# Altium schematic sheet 00_Welder_PSU.SchDoc
size A4; SheetNumber: 1; SheetTotal: 3
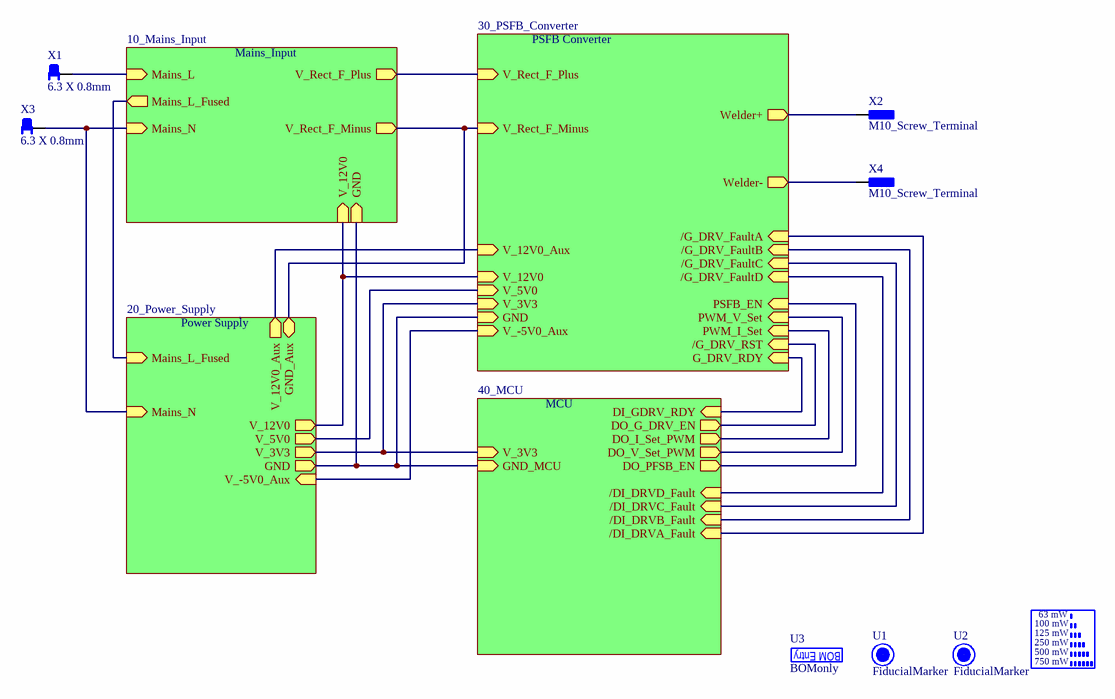
[diagram p0: 00_Welder_PSU.SchDoc]

## Parts
U1  FiducialMarker  [FiducialMarker]  (no BOM)
U2  FiducialMarker  [FiducialMarker]  (no BOM)
U3  BOMonly  (mechanical)
U?  ROVERVIEW  (value not drawn)  (graphical)
X1  6.3 X 0.8mm  [X01_FastonPCBTab6.3mm1.8mmHole]
X2  M10_Screw_Terminal  [X01_M10_7461061]
X3  6.3 X 0.8mm  [X01_FastonPCBTab6.3mm1.8mmHole]
X4  M10_Screw_Terminal  [X01_M10_7461061]

## Sub-sheets
Mains_Input = 10_Mains_Input: Mains_L (in), Mains_N (in), V_Rect_F_Plus (out), V_Rect_F_Minus (out), V_12V0 (in), GND (in), Mains_L_Fused (out)
MCU = 40_MCU: DO_I_Set_PWM (out), DO_V_Set_PWM (out), DO_PFSB_EN (out), V_3V3 (in), GND_MCU (in), DO_G_DRV_EN (out), /DI_DRVA_Fault (in), /DI_DRVB_Fault (in), /DI_DRVC_Fault (in), /DI_DRVD_Fault (in), DI_GDRV_RDY (in)
Power Supply = 20_Power_Supply: Mains_N (in), V_12V0 (out), V_5V0 (out), V_3V3 (out), GND (out), GND_Aux (bidir), V_12V0_Aux (out), V_-5V0_Aux (in), Mains_L_Fused (in)
PSFB Converter = 30_PSFB_Converter: V_Rect_F_Minus (in), V_Rect_F_Plus (in), V_12V0 (in), V_5V0 (in), V_3V3 (in), GND (in), PWM_I_Set (in), PWM_V_Set (in), PSFB_EN (in), Welder+ (out), Welder- (out), V_12V0_Aux (in), V_-5V0_Aux (in), /G_DRV_RST (in), /G_DRV_FaultA (in), /G_DRV_FaultC (in), /G_DRV_FaultB (in), /G_DRV_FaultD (in), G_DRV_RDY (in)

## Nets
NetX1_1: X1.1 ; sheet Mains_Input/Mains_L
NetX2_1: X2.1 ; sheet PSFB Converter/Welder+
NetX3_1: X3.1 ; sheet Mains_Input/Mains_N, sheet Power Supply/Mains_N
NetX4_1: X4.1 ; sheet PSFB Converter/Welder-
(unnamed): sheet Mains_Input/V_Rect_F_Plus, sheet PSFB Converter/V_Rect_F_Plus
(unnamed): sheet Mains_Input/V_Rect_F_Minus, sheet PSFB Converter/V_Rect_F_Minus, sheet Power Supply/GND_Aux
(unnamed): sheet Mains_Input/V_12V0, sheet PSFB Converter/V_12V0, sheet Power Supply/V_12V0
(unnamed): sheet Mains_Input/GND, sheet PSFB Converter/GND, sheet Power Supply/GND, sheet MCU/GND_MCU
(unnamed): sheet Mains_Input/Mains_L_Fused, sheet Power Supply/Mains_L_Fused
(unnamed): sheet PSFB Converter/V_5V0, sheet Power Supply/V_5V0
(unnamed): sheet PSFB Converter/V_3V3, sheet Power Supply/V_3V3, sheet MCU/V_3V3
(unnamed): sheet PSFB Converter/PWM_I_Set, sheet MCU/DO_I_Set_PWM
(unnamed): sheet PSFB Converter/PWM_V_Set, sheet MCU/DO_V_Set_PWM
(unnamed): sheet PSFB Converter/PSFB_EN, sheet MCU/DO_PFSB_EN
(unnamed): sheet PSFB Converter/V_12V0_Aux, sheet Power Supply/V_12V0_Aux
(unnamed): sheet PSFB Converter/V_-5V0_Aux, sheet Power Supply/V_-5V0_Aux
(unnamed): sheet PSFB Converter//G_DRV_RST, sheet MCU/DO_G_DRV_EN
(unnamed): sheet PSFB Converter//G_DRV_FaultA, sheet MCU//DI_DRVA_Fault
(unnamed): sheet PSFB Converter//G_DRV_FaultC, sheet MCU//DI_DRVC_Fault
(unnamed): sheet PSFB Converter//G_DRV_FaultB, sheet MCU//DI_DRVB_Fault
(unnamed): sheet PSFB Converter//G_DRV_FaultD, sheet MCU//DI_DRVD_Fault
(unnamed): sheet PSFB Converter/G_DRV_RDY, sheet MCU/DI_GDRV_RDY

Not connected (* = marked no-connect by the designer): U1 1; U2 1

## Notes on the sheet
- Assembly variant:
- DIN ISO 2768-mK
- DIN ISO 8015
- standards
- general
- replace for
- DIN EN ISO 1302
- surface
- material number
- description
- document
- number
- replace for index
- type
- version
- date
- drawn by
- checked
- File:
- mod.
- ind.
- quan.
- change number
- sheet
- of
- EBB
- ESP
- (in symbol 9) 63 mW; 100 mW; 125 mW; 250 mW; 500 mW; 750 mW; BOM Entry

## Library data of the parts
U1 U2 = 2: Part: Layout; ID: 2; Properties: Fiducial Marker for SMD Placement; Value: FiducialMarker; Manufacturer: *; Package: *; Price1k: *; Price100k: *; Distributor: *; Calculation: *; Information: *; ComponentLink1URL: C:\AltiumDesigner\Datasheets\Others\FiducialMarker\; ComponentLink1Description: Files Fiducial Marker
U3 = 9: Manufacturer: MANUFAKTURER; ID: 9; Properties: DESCRIBE THE THING YOU WANT TO HAVE IN THE BOM; Part: BOMonly; Value: *; Package: -; Price1k: ?; Price100k: ?; Distributor: -; Calculation: *; Information: -; ComponentLink1URL: -; ComponentLink1Description: -
U? = 9: Legend Resistor Power; ID: 9; Part: ROverView; Value: ROverView; Properties: Legend Resistor Power; Information: *
X1 X3 = 7471287: Faston Tab straight DIN46244T3 CuZn Sn plated, pitch 5.08mm,1.8mm locking hole; Manufacturer: Wurth; ID: 14; Verified Lib: False; Manufacturer P/N: 7471287; Category: Connector; Part_Value: 6.3 X 0.8mm; Package/Case: 6.3mmX0.8mm; Price: 0.03; created by: Hamad; created on: 8/13/2021
X2 X4 = 7461061: Connector 36 Pin Screw Terminal, Power Tap M10 Through Hole; Manufacturer: Wurth; ID: 17; Verified Lib: True; Our Stock: 4; Manufacturer P/N: 7461061; Category: Screw Terminal; Part_Value: M10_Screw_Terminal; Package/Case: 36 Pins M10; Supplier-1: Digikey; Price: 10.75; created by: Hamad; created on: 8/15/2021